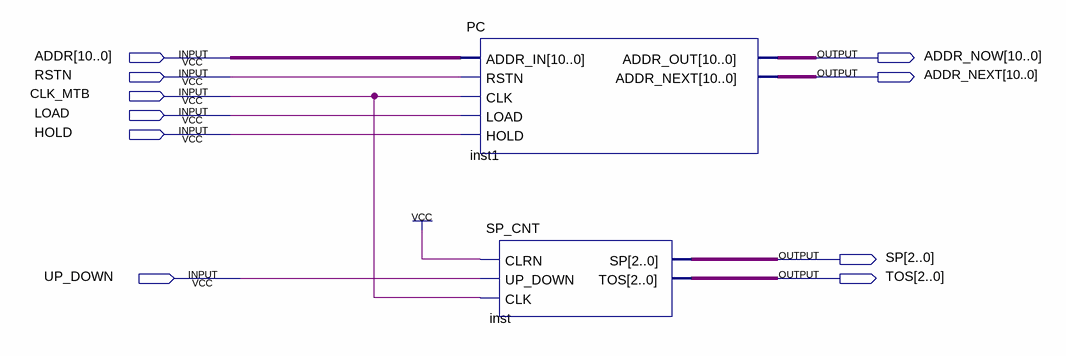
[diagram p0: schematic sheet]
// Quartus schematic PC_Mem_tb.bdf as structural Verilog: 2 symbols, 10 pins
module PC_Mem_tb (
  input  [10:0] ADDR,
  input  RSTN,
  input  CLK_MTB,
  input  LOAD,
  input  HOLD,
  input  UP_DOWN,
  output [10:0] ADDR_NOW,
  output [10:0] ADDR_NEXT,
  output [2:0] SP,
  output [2:0] TOS
);

  PC inst1 (
    .ADDR_IN(ADDR), .RSTN(RSTN), .CLK(CLK_MTB), .LOAD(LOAD), .HOLD(HOLD), .ADDR_OUT(ADDR_NOW),
    .ADDR_NEXT(ADDR_NEXT));
  SP_CNT inst (.CLRN(1'b1), .UP_DOWN(UP_DOWN), .CLK(CLK_MTB), .SP(SP), .TOS(TOS));
endmodule
